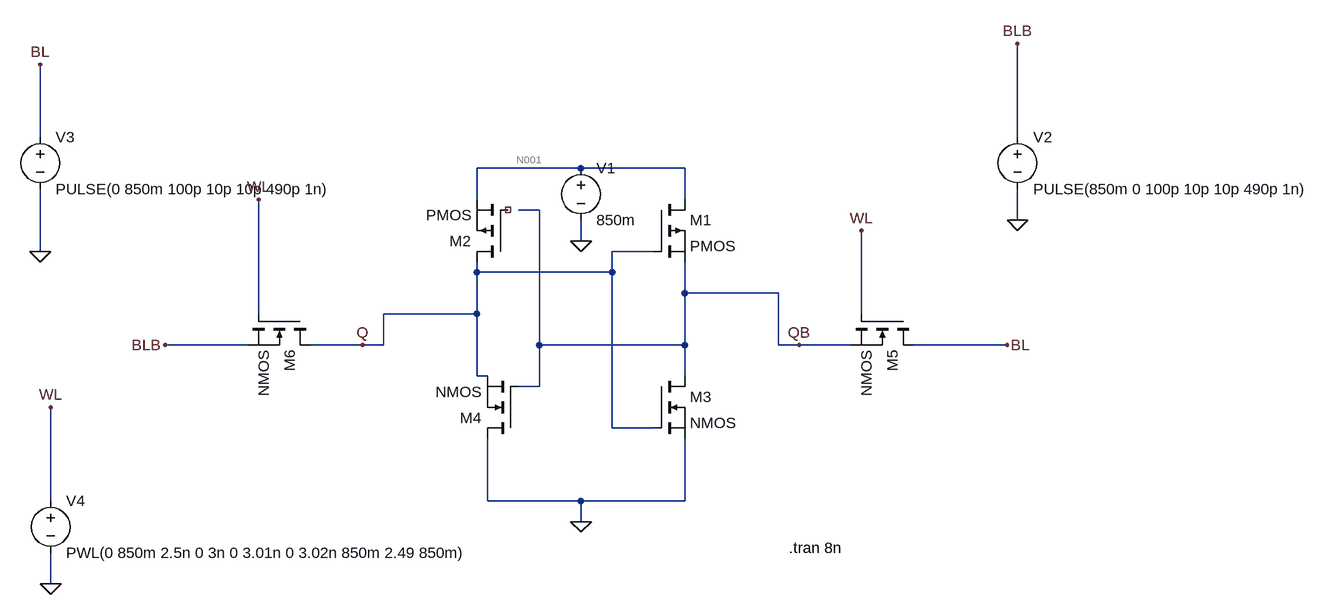
[diagram p0: schematic 6T sram trans.asc]
6T sram trans.asc, the LTspice schematic file:
Version 4
SHEET 1 1328 680
WIRE -656 -32 -656 -144
WIRE 848 -32 848 -176
WIRE 176 16 16 16
WIRE 336 16 176 16
WIRE 16 64 16 16
WIRE 336 64 336 16
WIRE 112 80 80 80
WIRE 848 96 848 48
WIRE 176 128 176 96
WIRE -656 144 -656 48
WIRE 288 144 224 144
WIRE 16 176 16 160
WIRE 224 176 224 144
WIRE 224 176 16 176
WIRE 336 208 336 160
WIRE 480 208 336 208
WIRE -320 240 -320 64
WIRE 16 240 16 176
WIRE 16 240 -128 240
WIRE 608 240 608 112
WIRE -336 288 -464 288
WIRE -160 288 -240 288
WIRE -128 288 -128 240
WIRE -128 288 -160 288
WIRE 112 288 112 80
WIRE 336 288 336 208
WIRE 336 288 112 288
WIRE 480 288 480 208
WIRE 512 288 480 288
WIRE 592 288 512 288
WIRE 832 288 688 288
WIRE 16 336 16 240
WIRE 32 336 16 336
WIRE 336 336 336 288
WIRE 112 352 112 288
WIRE 112 352 80 352
WIRE 224 416 224 176
WIRE 288 416 224 416
WIRE -640 528 -640 384
WIRE 32 528 32 432
WIRE 176 528 32 528
WIRE 336 528 336 432
WIRE 336 528 176 528
WIRE 176 560 176 528
WIRE -640 656 -640 608
FLAG 176 560 0
FLAG -656 144 0
FLAG -640 656 0
FLAG 176 128 0
FLAG 848 96 0
FLAG 608 112 WL
FLAG -320 64 WL
FLAG 832 288 BL
FLAG -656 -144 BL
FLAG -464 288 BLB
FLAG 848 -176 BLB
FLAG -640 384 WL
FLAG -160 288 Q
FLAG 512 288 QB
SYMBOL pmos 288 64 R0
SYMATTR InstName M1
SYMBOL pmos 64 160 R180
SYMATTR InstName M2
SYMBOL nmos 288 336 R0
SYMATTR InstName M3
SYMBOL nmos 80 432 R180
SYMATTR InstName M4
SYMBOL nmos 688 240 R90
SYMATTR InstName M5
SYMBOL nmos -240 240 R90
SYMATTR InstName M6
SYMBOL voltage 176 0 R0
WINDOW 123 0 0 Left 0
WINDOW 39 0 0 Left 0
SYMATTR InstName V1
SYMATTR Value 850m
SYMBOL voltage 848 -48 R0
WINDOW 123 0 0 Left 0
WINDOW 39 0 0 Left 0
SYMATTR InstName V2
SYMATTR Value PULSE(850m 0 100p 10p 10p 490p 1n)
SYMBOL voltage -656 -48 R0
WINDOW 123 0 0 Left 0
WINDOW 39 0 0 Left 0
SYMATTR InstName V3
SYMATTR Value PULSE(0 850m 100p 10p 10p 490p 1n)
SYMBOL voltage -640 512 R0
WINDOW 123 0 0 Left 0
WINDOW 39 0 0 Left 0
SYMATTR InstName V4
SYMATTR Value PWL(0 850m 2.5n 0 3n 0 3.01n 0 3.02n 850m 2.49 850m)
TEXT 496 600 Left 2 !.tran 8n

The netlist it stands for:
* 6T sram trans.asc
M1 N001 Q QB QB PMOS
M2 Q NC_01 N001 N001 PMOS
M3 QB Q 0 0 NMOS
M4 0 QB Q Q NMOS
M5 BL WL QB QB NMOS
M6 Q WL BLB BLB NMOS
V1 N001 0 850m
V2 BLB 0 PULSE(850m 0 100p 10p 10p 490p 1n)
V3 BL 0 PULSE(0 850m 100p 10p 10p 490p 1n)
V4 WL 0 PWL(0 850m 2.5n 0 3n 0 3.01n 0 3.02n 850m 2.49 850m)
.model NMOS NMOS
.model PMOS PMOS
.lib standard.mos
.tran 8n
.backanno
.end

* Results of the author's LTspice run, read from the files saved beside the schematic
* Operating Point, zero values left out:
*   V(n001) = 850 mV
*   V(q) = 515.9 mV
*   V(qb) = 328.5 mV
*   V(wl) = 850 mV
*   V(blb) = 850 mV
*   Id(M1) = 6.82 µA
*   Ib(M1) = -5.704 µA
*   Is(M1) = -1.116 µA
*   Id(M2) = -4.563 µA
*   Is(M2) = 4.563 µA
*   Id(M3) = 2.311 µA
*   Is(M3) = -2.311 µA
*   Id(M4) = -5.683 µA
*   Ib(M4) = 4.604 µA
*   Is(M4) = 1.079 µA
*   Id(M5) = -4.509 µA
*   Ib(M5) = 3.282 nA
*   Is(M5) = 4.506 µA
*   Id(M6) = -1.12 µA
*   Ib(M6) = 4.066 nA
*   Is(M6) = 1.116 µA
*   I(V1) = -11.38 µA
*   I(V2) = -1.12 µA
*   I(V3) = 4.509 µA
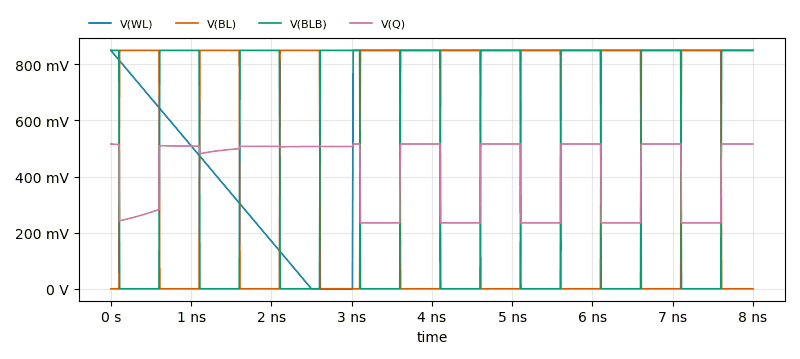
[diagram p1: Transient Analysis of 6T sram trans.asc, plotted from the saved traces]
* Transient Analysis, 1 run:
*   V(WL): min 0 V, max 850 mV, average 662.5 mV, rms 724.9 mV, last 850 mV
*   V(BL): min 0 V, max 850 mV, average 425 mV, rms 599.2 mV, last 0 V
*   V(BLB): min 0 V, max 850 mV, average 425 mV, rms 599.2 mV, last 850 mV
*   V(Q): min 234.9 mV, max 516 mV, average 409.6 mV, rms 430 mV, last 515.9 mV